# EAGLE design EIB32-JAE_MC-Av2 (EAGLE 9.4.2)
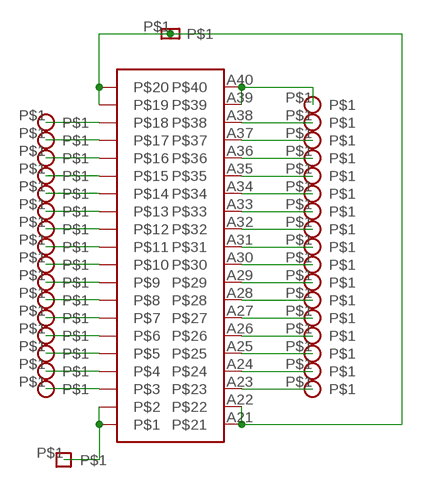
[diagram p0: schematic, sheet 1]

## Parts
U$1  WR-40SB-VFH30  [WR-40SB-VFH30]
U$2  EIB-GND-HOLE-PAD-SMALL  [EIB-GND-HOLE-PAD-SMALL]
U$3  EIB-GND-HOLE-PAD  [EIB-GND-HOLE-PAD]
U$5  EIB-TETRODE-HOLE-RS-PAD  [EIB-TETRODE-HOLE-RS-PAD]
U$6  EIB-TETRODE-HOLE-RS-PAD  [EIB-TETRODE-HOLE-RS-PAD]
U$7  EIB-TETRODE-HOLE-RS-PAD  [EIB-TETRODE-HOLE-RS-PAD]
U$8  EIB-TETRODE-HOLE-RS-PAD  [EIB-TETRODE-HOLE-RS-PAD]
U$9  EIB-TETRODE-HOLE-RS-PAD  [EIB-TETRODE-HOLE-RS-PAD]
U$10  EIB-TETRODE-HOLE-RS-PAD  [EIB-TETRODE-HOLE-RS-PAD]
U$11  EIB-TETRODE-HOLE-RS-PAD  [EIB-TETRODE-HOLE-RS-PAD]
U$12  EIB-TETRODE-HOLE-RS-PAD  [EIB-TETRODE-HOLE-RS-PAD]
U$13  EIB-TETRODE-HOLE-RS-PAD  [EIB-TETRODE-HOLE-RS-PAD]
U$14  EIB-TETRODE-HOLE-RS-PAD  [EIB-TETRODE-HOLE-RS-PAD]
U$15  EIB-TETRODE-HOLE-RS-PAD  [EIB-TETRODE-HOLE-RS-PAD]
U$16  EIB-TETRODE-HOLE-RS-PAD  [EIB-TETRODE-HOLE-RS-PAD]
U$17  EIB-TETRODE-HOLE-RS-PAD  [EIB-TETRODE-HOLE-RS-PAD]
U$18  EIB-TETRODE-HOLE-RS-PAD  [EIB-TETRODE-HOLE-RS-PAD]
U$19  EIB-TETRODE-HOLE-RS-PAD  [EIB-TETRODE-HOLE-RS-PAD]
U$20  EIB-TETRODE-HOLE-RS-PAD  [EIB-TETRODE-HOLE-RS-PAD]
U$22  EIB-TETRODE-HOLE-RS-PAD  [EIB-TETRODE-HOLE-RS-PAD]
U$23  EIB-TETRODE-HOLE-RS-PAD  [EIB-TETRODE-HOLE-RS-PAD]
U$24  EIB-TETRODE-HOLE-RS-PAD  [EIB-TETRODE-HOLE-RS-PAD]
U$25  EIB-TETRODE-HOLE-RS-PAD  [EIB-TETRODE-HOLE-RS-PAD]
U$26  EIB-TETRODE-HOLE-RS-PAD  [EIB-TETRODE-HOLE-RS-PAD]
U$27  EIB-TETRODE-HOLE-RS-PAD  [EIB-TETRODE-HOLE-RS-PAD]
U$28  EIB-TETRODE-HOLE-RS-PAD  [EIB-TETRODE-HOLE-RS-PAD]
U$29  EIB-TETRODE-HOLE-RS-PAD  [EIB-TETRODE-HOLE-RS-PAD]
U$30  EIB-TETRODE-HOLE-RS-PAD  [EIB-TETRODE-HOLE-RS-PAD]
U$31  EIB-TETRODE-HOLE-RS-PAD  [EIB-TETRODE-HOLE-RS-PAD]
U$32  EIB-TETRODE-HOLE-RS-PAD  [EIB-TETRODE-HOLE-RS-PAD]
U$33  EIB-TETRODE-HOLE-RS-PAD  [EIB-TETRODE-HOLE-RS-PAD]
U$34  EIB-TETRODE-HOLE-RS-PAD  [EIB-TETRODE-HOLE-RS-PAD]
U$35  EIB-TETRODE-HOLE-RS-PAD  [EIB-TETRODE-HOLE-RS-PAD]
U$36  EIB-TETRODE-HOLE-RS-PAD  [EIB-TETRODE-HOLE-RS-PAD]
U$37  EIB-TETRODE-HOLE-RS-PAD  [EIB-TETRODE-HOLE-RS-PAD]
U$38  EIB-TETRODE-HOLE-RS-PAD  [EIB-TETRODE-HOLE-RS-PAD]

## Nets
N$1: U$1.A19 U$1.A20 U$1.A21 U$1.A22 U$2.P$1
N$2: U$1.A1 U$1.A2 U$3.P$1
N$3: U$1.A39 U$1.A40 U$22.P$1
N$6: U$1.A18 U$5.P$1
N$7: U$1.A17 U$6.P$1
N$8: U$1.A16 U$7.P$1
N$9: U$1.A15 U$8.P$1
N$10: U$1.A14 U$9.P$1
N$11: U$1.A13 U$10.P$1
N$12: U$1.A12 U$11.P$1
N$13: U$1.A11 U$12.P$1
N$14: U$1.A10 U$13.P$1
N$15: U$1.A9 U$14.P$1
N$16: U$1.A8 U$15.P$1
N$17: U$1.A7 U$16.P$1
N$18: U$1.A6 U$17.P$1
N$19: U$1.A5 U$18.P$1
N$20: U$1.A4 U$19.P$1
N$21: U$1.A3 U$20.P$1
N$24: U$1.A38 U$23.P$1
N$25: U$1.A37 U$24.P$1
N$26: U$1.A36 U$25.P$1
N$27: U$1.A35 U$26.P$1
N$28: U$1.A34 U$27.P$1
N$29: U$1.A33 U$28.P$1
N$30: U$1.A32 U$29.P$1
N$31: U$1.A31 U$30.P$1
N$32: U$1.A30 U$31.P$1
N$33: U$1.A29 U$32.P$1
N$34: U$1.A28 U$33.P$1
N$35: U$1.A27 U$34.P$1
N$36: U$1.A26 U$35.P$1
N$37: U$1.A25 U$36.P$1
N$38: U$1.A24 U$37.P$1
N$39: U$1.A23 U$38.P$1

## Library data of the parts
U$1 = EIBLibrary:WR-40SB-VFH30
U$2 = EIBLibrary:EIB-GND-HOLE-PAD-SMALL
U$3 = EIBLibrary:EIB-GND-HOLE-PAD
U$5-U$20 U$22-U$38 = EIBLibrary:EIB-TETRODE-HOLE-RS-PAD

## Board
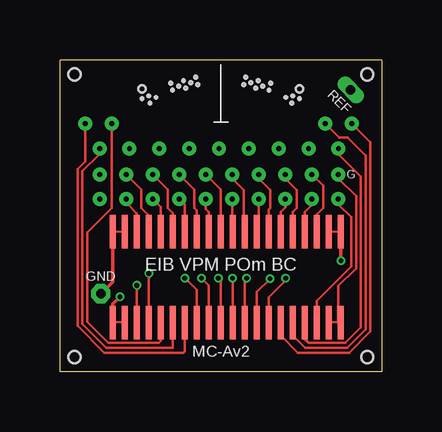
[diagram p1: board, top side]
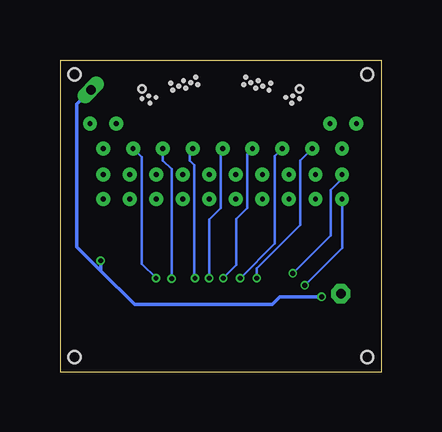
[diagram p2: board, bottom side, seen from below]

Size 13.4 x 13 mm. Coordinates in mm from the lower left corner, seen from the top.
Outline: 0,0 0,13 13.4,13 13.4,0 0,0
Copper layers (1*16): Top 0.012mm / dielectric 1.55mm / Bottom 0.012mm
Design rules "Multi-CB_2L_075um-Tracks_OL35um": minimum track width 0.075mm, minimum drill 0.1mm, track to track 0.085mm, track to pad 0.085mm, pad to pad 0.085mm, via to via 0.085mm, smd to smd 0mil, copper to edge 0.2mm, drill to drill 0.2mm, minimum pad ring 0.125mm, minimum via ring 0.075mm, stop-mask expansion 2mil, vias tented up to drill 0.45mm, thermal gap 0.2mm
Holes 0.5 mm at 12.8,12.4 0.6,0.6 12.8,0.6 0.6,12.4
Holes 0.1 mm at 7.95,12.05 8.45,11.9 8.26,12.13 7.75,12.28 7.66,11.97 8.15,11.82 9.7,11.5 8.79,12.03 9.4,11.44 9.98,11.38 9.65,11.2 5.45,12.05 4.95,11.9 5.14,12.13 5.66,12.28 5.75,11.97 5.25,11.82 3.7,11.5 4.62,12.03 4,11.44 3.42,11.38 3.75,11.2 8.71,11.73 4.69,11.73
Holes 0.3 mm at 9.98,11.79 3.42,11.79

### Footprints (pad centres in the part's own frame; a part is rotated, then mirrored left to right if it is on the bottom)
WR-40SB-VFH30 = smd 0.25 x 1.4: A1 0,0; A2 0.5,0; A3 1,0; A4 1.5,0; A5 2,0; A6 2.5,0; A7 3,0; A8 3.5,0; A9 4,0; A10 4.5,0; A11 5,0; A12 5.5,0; A13 6,0; A14 6.5,0; A15 7,0; A16 7.5,0; A17 8,0; A18 8.5,0; A19 9,0; A20 9.5,0; A21 0,-3.8; A22 0.5,-3.8; A23 1,-3.8; A24 1.5,-3.8; A25 2,-3.8; A26 2.5,-3.8; A27 3,-3.8; A28 3.5,-3.8; A29 4,-3.8; A30 4.5,-3.8; A31 5,-3.8; A32 5.5,-3.8; A33 6,-3.8; A34 6.5,-3.8; A35 7,-3.8; A36 7.5,-3.8; A37 8,-3.8; A38 8.5,-3.8; A39 9,-3.8; A40 9.5,-3.8
EIB-GND-HOLE-PAD-SMALL = drill 0.4 pad 0.41 long: P$1 0,0
EIB-GND-HOLE-PAD = drill 0.4 pad 0.8 octagon: P$1 0,0
EIB-TETRODE-HOLE-RS-PAD = drill 0.2 pad 0.58: P$1 0,0

### Placement (x,y rotation side)
U$1  2.2,5.84 0 top
U$2  12.11,11.75 315 top
U$3  1.7,3.25 0 top
U$5  10.49,8.22 180 top
U$6  10.49,7.2 180 top
U$7  9.39,8.22 180 top
U$8  9.39,7.2 180 top
U$9  8.28,8.22 180 top
U$10  8.28,7.2 90 top
U$11  7.18,8.22 90 top
U$12  7.18,7.2 90 top
U$13  6.07,8.22 90 top
U$14  6.07,7.2 90 top
U$15  4.97,8.22 90 top
U$16  4.97,7.2 180 top
U$17  3.86,8.22 180 top
U$18  3.86,7.2 180 top
U$19  2.76,8.22 180 top
U$20  2.76,7.2 180 top
U$22  11.6,8.22 90 top
U$23  11.6,7.2 90 top
U$24  11.6,9.3 90 top
U$25  11.05,10.35 90 top
U$26  12.15,10.35 90 top
U$27  10.36,9.3 270 top
U$28  9.11,9.3 270 top
U$29  7.87,9.3 270 top
U$30  6.62,9.3 270 top
U$31  5.38,9.3 90 top
U$32  4.14,9.3 90 top
U$33  2.89,9.3 90 top
U$34  1.05,10.35 180 top
U$35  1.65,9.3 0 top
U$36  2.15,10.35 180 top
U$37  1.65,8.22 180 top
U$38  1.65,7.2 180 top

### Tracks (layer width: path | path; a pad name or v marks a point on that pad's centre or on a via)
N$1  (via drill 0.2)
  Top 0.075: U$1.A22 2.64,2.08 2.24,2.08 U$1.A21 | U$1.A19 U$1.A20
  Top 0.15: U$1.A21 2.2,2.82 v2.5,3.12 | U$1.A20 v11.7,4.63 v11.71,4.62
  Bottom 0.15: v2.5,3.12 4.24,3.12 4.56,2.79 10.29,2.79 11.71,4.21 | 11.71,4.21 v11.71,4.62 | 11.71,4.21 12.7,5.2 12.7,11.16 U$2.P$1
N$2
  Top 0.075: U$1.A1 U$1.A2
  Top 0.15: U$3.P$1 2.2,3.75 U$1.A1
N$3
  Top 0.075: U$22.P$1 11.6,8.16 11.6,8.08 11.6,8.05 | U$1.A40 11.6,2.08 11.2,2.08 U$1.A39
  Top 0.1: U$1.A40 11.6,2.14 11.6,3.57 12.34,4.3 12.34,7.32 11.6,8.05
N$6
  Top 0.1: U$1.A18 10.7,6.55 10.96,6.82 10.96,7.75 U$5.P$1
N$7
  Top 0.1: U$6.P$1 10.49,6.94 10.2,6.65 U$1.A17
N$8
  Top 0.1: U$7.P$1 9.39,8.05 9.86,7.58 9.86,6.82 9.7,6.66 U$1.A16
N$9
  Top 0.1: U$8.P$1 9.39,6.84 9.2,6.65 U$1.A15
N$10
  Top 0.1: U$9.P$1 8.28,8.05 8.75,7.58 8.75,6.82 8.7,6.76 U$1.A14
N$11
  Top 0.1: U$10.P$1 8.28,5.92 U$1.A13
N$12
  Top 0.1: U$11.P$1 7.18,8.05 7.65,7.58 7.65,5.89 U$1.A12
N$13
  Top 0.1: U$12.P$1 7.18,5.86 U$1.A11
N$14
  Top 0.1: U$13.P$1 6.7,7.6 U$1.A10
N$15
  Top 0.1: U$14.P$1 6.07,6.78 6.2,6.65 U$1.A9
N$16
  Top 0.1: U$15.P$1 5.6,7.59 5.6,6.82 5.7,6.72 U$1.A8
N$17
  Top 0.1: U$16.P$1 5.2,6.97 U$1.A7
N$18
  Top 0.1: U$17.P$1 4.5,7.59 4.5,6.82 4.7,6.62 U$1.A6
N$19
  Top 0.1: U$18.P$1 4.2,6.86 U$1.A5
N$20
  Top 0.1: U$1.A4 3.7,6.51 3.39,6.82 3.39,7.59 U$19.P$1
N$21
  Top 0.1: U$20.P$1 2.76,7.04 3.2,6.6 U$1.A3
N$24
  Top 0.1: U$1.A38 10.7,2.95 12.13,4.38 12.13,6.44 11.6,6.98 U$23.P$1
N$25
  Top 0.1: U$24.P$1 11.6,9.08 12.54,8.14 12.54,1.84 11.89,1.19 10.36,1.19 10.2,1.35 U$1.A37
N$26
  Top 0.1: U$1.A36 9.7,1.5 10.21,0.99 11.97,0.99 12.73,1.75 12.73,9.02 11.98,9.77 11.63,9.77 U$25.P$1
N$27
  Top 0.1: U$1.A35 9.2,1.5 9.91,0.79 12.05,0.79 12.94,1.67 12.94,9.56 U$26.P$1
N$28  (via drill 0.2)
  Top 0.1: v9.4,3.9 9.4,3.8 8.7,3.1 U$1.A34
  Bottom 0.1: v9.4,3.9 10,4.5 10,8.94 U$27.P$1
N$29  (via drill 0.2)
  Top 0.1: v8.75,3.88 8.2,3.33 U$1.A33
  Bottom 0.1: v8.75,3.88 8.75,6.82 8.75,8.45 9.11,8.81 U$28.P$1
N$30  (via drill 0.2)
  Top 0.1: v7.78,3.9 7.7,3.83 U$1.A32
  Bottom 0.1: U$29.P$1 8,9.17 8,8.79 7.81,8.61 7.81,3.94 v7.78,3.9
N$31  (via drill 0.2)
  Top 0.1: v7.19,3.9 7.19,2.05 U$1.A31
  Bottom 0.1: v7.19,3.9 7.19,6.34 6.71,6.82 6.71,7.39 6.7,7.4 6.7,9.22 U$30.P$1
N$32  (via drill 0.2)
  Top 0.1: v6.6,3.9 6.7,3.8 U$1.A30
  Bottom 0.1: U$31.P$1 5.6,9.08 5.6,6.82 6.05,6.37 6.05,4.45 v6.6,3.9
N$33  (via drill 0.2)
  Top 0.1: v5.89,3.89 6.2,3.58 U$1.A29
  Bottom 0.1: v5.89,3.89 4.45,5.33 4.45,8.99 U$32.P$1
N$34  (via drill 0.2)
  Top 0.1: v5.2,3.9 5.7,3.4 U$1.A28
  Bottom 0.1: v5.2,3.9 5.2,4.3 3.39,6.11 3.39,8.8 U$33.P$1
N$35
  Top 0.1: U$34.P$1 1.05,8.76 0.73,8.44 0.73,1.91 1.85,0.79 5.14,0.79 5.2,0.85 U$1.A27
N$36
  Top 0.1: U$35.P$1 1.65,9.08 0.93,8.36 0.93,1.99 1.93,0.99 4.69,0.99 4.7,1 U$1.A26
N$37
  Top 0.1: U$1.A25 4.2,1.29 4.1,1.19 2.01,1.19 1.13,2.07 1.13,5.81 2.15,6.83 U$36.P$1
N$38  (via drill 0.2)
  Top 0.1: U$1.A24 v3.7,4.1
  Bottom 0.1: U$37.P$1 1.65,8.05 2.12,7.58 2.12,5.68 v3.7,4.1
N$39  (via drill 0.2)
  Top 0.1: U$1.A23 v3.2,3.6
  Bottom 0.1: v3.2,3.6 1.65,5.15 U$38.P$1

### Text on the board
tPlace: REF | G | GND | EIB VPM POm BC
tNames: MC-Av2